# Altium schematic sheet V2.SchDoc
size A3
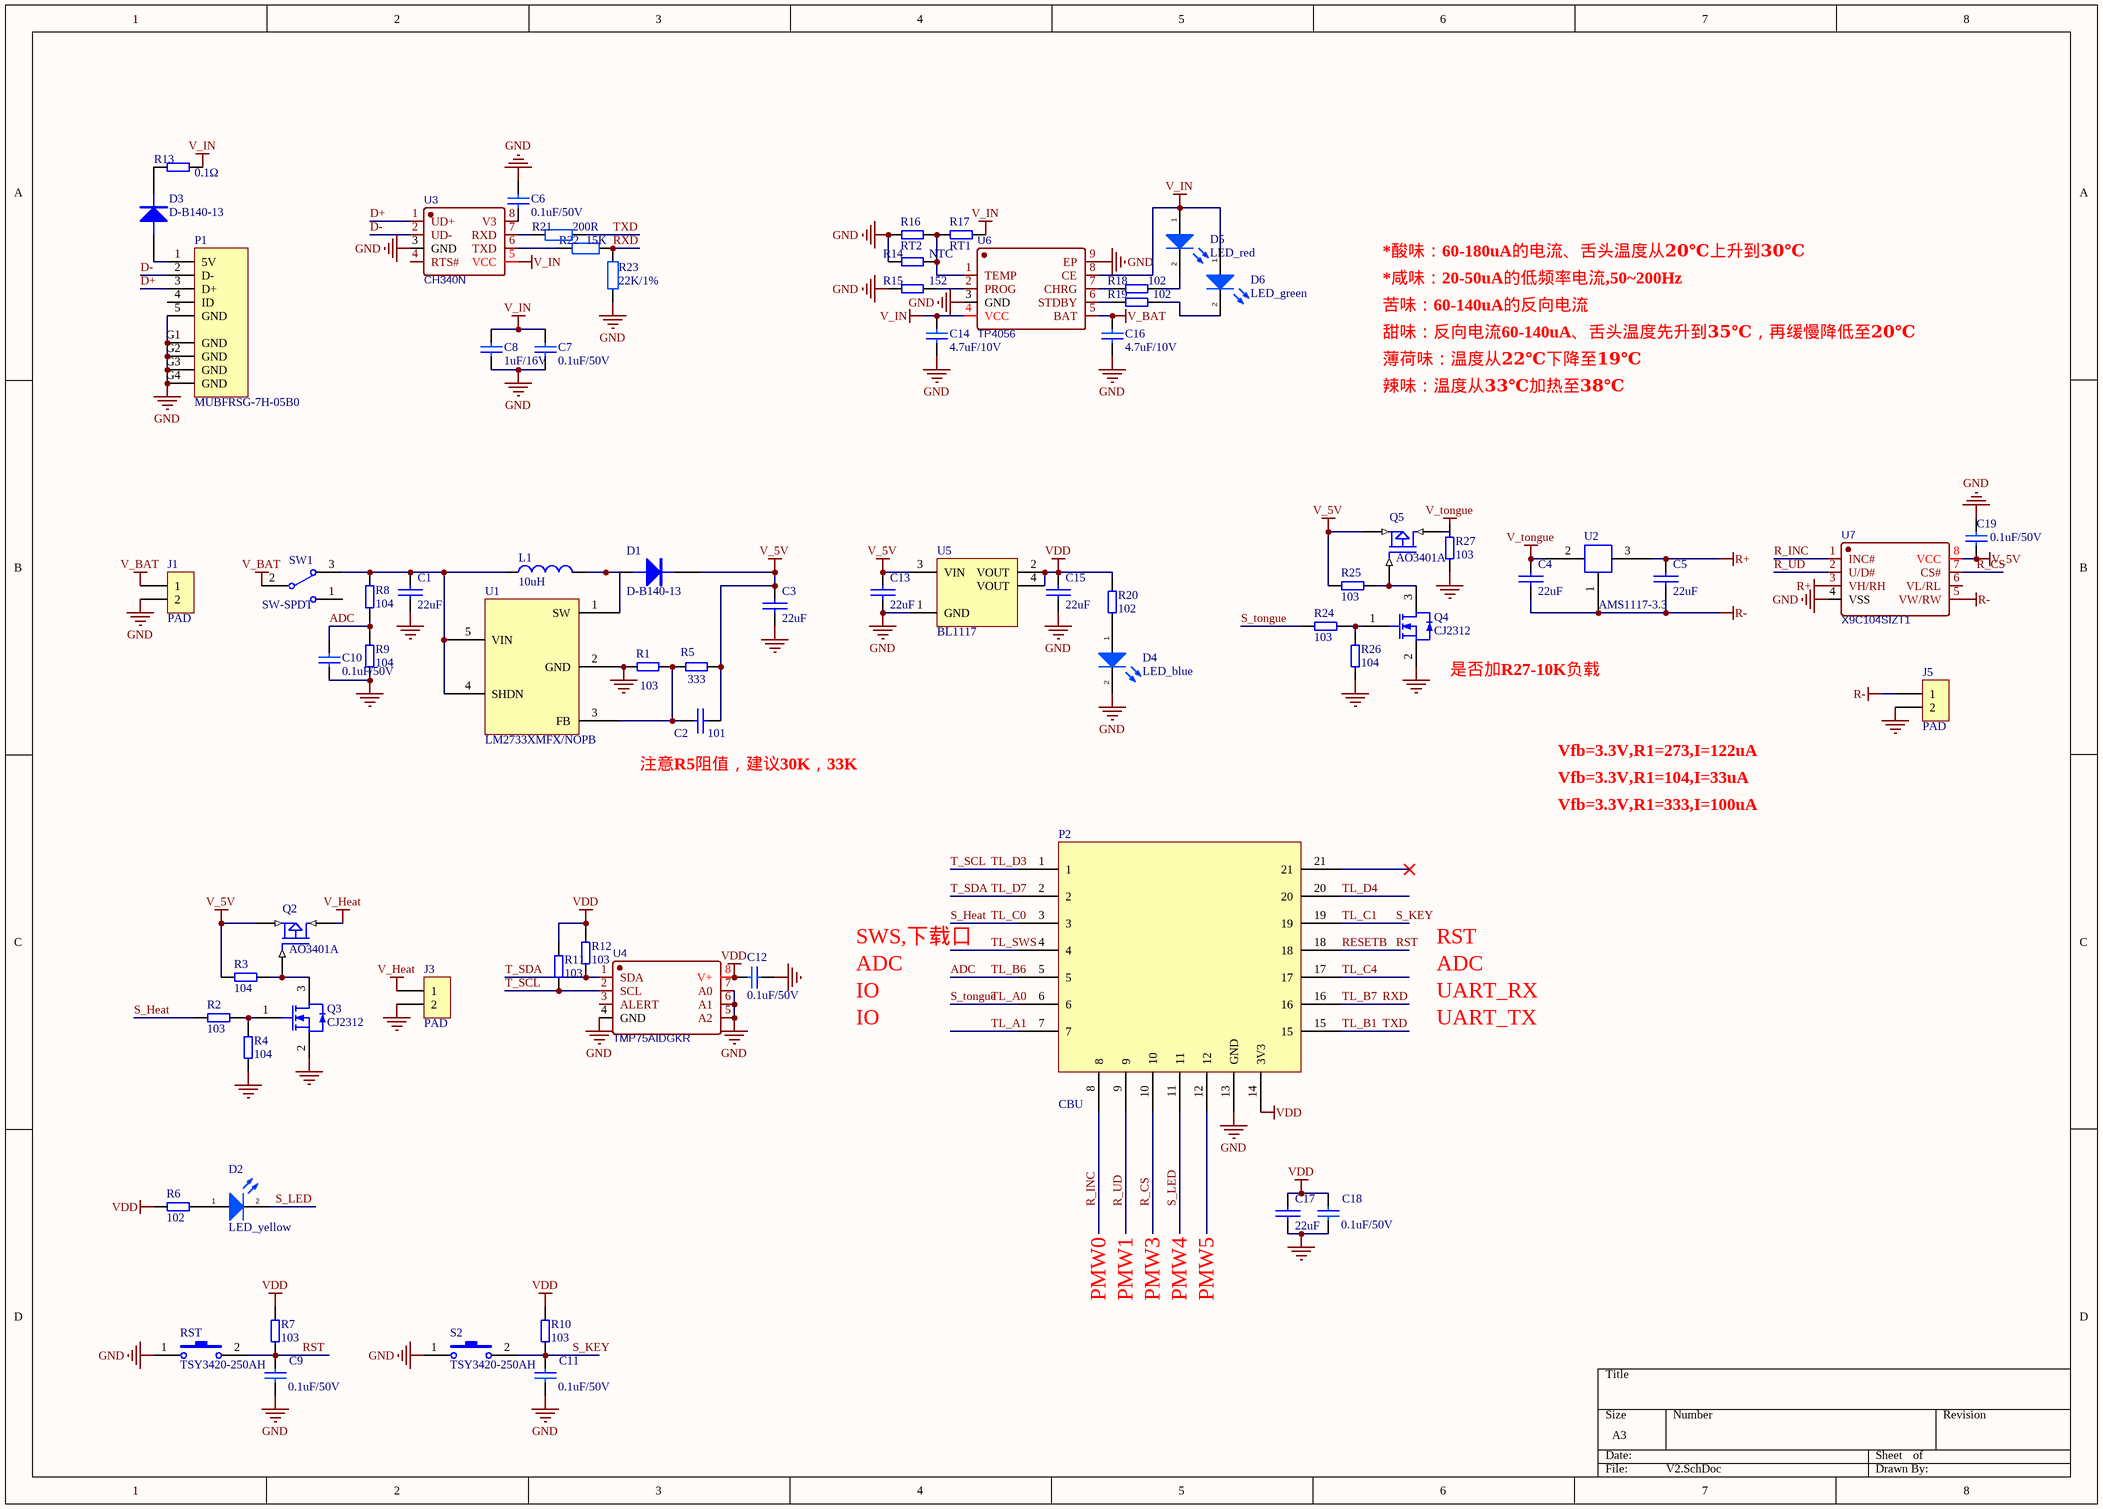
[diagram p0: V2.SchDoc]

## Parts
C1  22uF  [C1206]
C2  101  [C0603]
C3  22uF  [C1206]
C4  22uF  [C1206]
C5  22uF  [C1206]
C6  0.1uF/50V  [C0603_GRM18]
C7  0.1uF/50V  [C0603_GRM18]
C8  1uF/16V  [C0603_GRM18]
C9  0.1uF/50V  [C0603_GRM18]
C10  0.1uF/50V  [C0603_GRM18]
C11  0.1uF/50V  [C0603_GRM18]
C12  0.1uF/50V  [C0603_GRM18]
C13  22uF  [C1206]
C14  4.7uF/10V  [C0603_GRM18]
C15  22uF  [C1206]
C16  4.7uF/10V  [C0603_GRM18]
C17  22uF  [C1206]
C18  0.1uF/50V  [C0603_GRM18]
C19  0.1uF/50V  [C0603_GRM18]
D1  D-B140-13  [XF-SS12C]
D2  LED_yellow  [LED0603]
D3  D-B140-13  [XF-SS12C]
D4  LED_blue  [LED0603]
D5  LED_red  [LED0603]
D6  LED_green  [LED0603]
J1  PAD  [POW_5#]
J3  PAD  [HDR1X2]
J5  PAD  [HDR1X2]
L1  value 10uH  [CD73]  (hidden comment: 4.7uH)
P1  MUBFRSG-7H-05B0  [MIRCOUSB_5PIN-A]
P2  CBU  [CBU-PCBA]
Q2  AO3401A  [SOT-23]
Q3  CJ2312  [SOT23-3]
Q4  CJ2312  [SOT23-3]
Q5  AO3401A  [SOT-23]
R1  103  [R0603]
R2  103  [R0603]
R3  104  [R0603]
R4  104  [R0603]
R5  333  [R0603]
R6  102  [R0603]
R7  103  [R0603]
R8  104  [R0603]
R9  104  [R0603]
R10  103  [R0603]
R11  103  [R0603]
R12  103  [R0603]
R13  0.1Ω  [R0603]
R14  NTC  [R0603]
R15  152  [R0603]
R16  RT2  [R0603]
R17  RT1  [R0603]
R18  102  [R0603]
R19  102  [R0603]
R20  102  [R0603]
R21  200R  [R0603]
R22  15K  [R0603]
R23  22K/1%  [R0603]
R24  103  [R0603]
R25  103  [R0603]
R26  104  [R0603]
R27  103  [R0603]
RST  TSY3420-250AH  [SW-PB2_SMT-3X4]
S2  TSY3420-250AH  [SW-PB2_SMT-3X4]
SW1  SW-SPDT  [pow_switch]
U1  LM2733XMFX/NOPB  [SOT23-5]
U2  AMS1117-3.3  [SOT-89C]
U3  CH340N  [SOP-8]
U4  TMP75AIDGKR  [VSSOP-8_L3.0-W3.0-P0.65-LS5.0-BL]
U5  BL1117  [SOT-223]
U6  TP4056  [ESOP-8]
U7  X9C104SIZT1  [SOIC-8_L4.9-W3.9-P1.27-LS6.0-BL]

## Nets
GND: C1.2 C3.2 C6.2 C7.1 C8.1 C9.2 C10.1 C11.2 C12.1 C13.2 C14.1 C15.2 C16.1 C17.2 C18.2 C19.2 D4.2 J1.2 J3.2 J5.2 P1.5(GND) P1.G1(GND) P1.G2(GND) P1.G3(GND) P1.G4(GND) P2.13(GND) Q3.2(S) Q4.2(S) R1.1 R4.1 R9.1 R14.2 R15.2 R16.1 R23.1 R26.1 R27.1 RST.1 S2.1 U1.2(GND) U3.3(GND) U4.4(GND) U4.5(A2) U4.6(A1) U4.7(A0) U5.1(GND) U6.3(GND) U6.9(EP) U7.4(VSS)
R+: C5.1 U2.3 U7.3(VH/RH)
R-: C4.2 C5.2 J5.1 U2.1 U7.5(VW/RW)
V_5V: C2.1 C3.1 C13.1 C19.1 D1.K Q2.S Q5.S R3.1 R5.1 R25.1 U5.3(VIN) U7.8(VCC)
V_BAT: C16.2 J1.1 SW1.2 U6.5(BAT)
V_Heat: J3.1 Q2.D
V_IN: C7.2 C8.2 C14.2 D5.1 D6.1 R13.1 R17.1 U3.5(VCC) U6.4(VCC) U6.8(CE)
V_tongue: C4.1 Q5.D U2.2
VDD: C12.2 C15.1 C17.1 C18.1 P2.14(3V3) R6.1 R7.2 R10.2 R11.2 R12.2 R20.2 U4.8(V+) U5.2(VOUT) U5.4(VOUT)
ADC: C10.2 P2.5 R8.1 R9.2  [also labelled TL_B6]
D+: P1.3(D+) U3.1(UD+)
D-: P1.2(D-) U3.2(UD-)
R_CS: P2.10 U7.7(CS#)
R_INC: P2.8 U7.1(INC#)
R_UD: P2.9 U7.2(U/D#)
RESETB: C9.1 P2.18 R7.1 RST.2  [also labelled RST]
RXD: P2.16 R22.2 R23.2  [also labelled TL_B7]
S_Heat: P2.3 R2.1  [also labelled TL_C0]
S_KEY: C11.1 P2.19 R10.1 S2.2  [also labelled TL_C1]
S_LED: D2.2 P2.11
S_tongue: P2.6 R24.1  [also labelled TL_A0]
T_SCL: P2.1 R11.1 U4.2(SCL)  [also labelled TL_D3]
T_SDA: P2.2 R12.1 U4.1(SDA)  [also labelled TL_D7]
TL_A1: P2.7
TL_B1: P2.15 R21.2  [also labelled TXD]
TL_C4: P2.17
TL_D4: P2.20
TL_SWS: P2.4
NetC1_1: C1.1 L1.1 R8.2 SW1.3 U1.4(SHDN) U1.5(VIN)
NetC2_2: C2.2 R1.2 R5.2 U1.3(FB)
NetC6_1: C6.1 U3.8(V3)
NetD1_A: D1.A L1.2 U1.1(SW)
NetD2_1: D2.1 R6.2
NetD3_A: D3.A P1.1(5V)
NetD3_K: D3.K R13.2
NetD4_1: D4.1 R20.1
NetD5_2: D5.2 R18.2
NetD6_2: D6.2 R19.1
NetQ2_G: Q2.G Q3.3(D) R3.2
NetQ3_1: Q3.1(G) R2.2 R4.2
NetQ4_1: Q4.1(G) R24.2 R26.2
NetQ4_3: Q4.3(D) Q5.G R25.2
NetR14_1: R14.1 R16.2 R17.2 U6.1(TEMP)
NetR15_1: R15.1 U6.2(PROG)
NetR18_1: R18.1 U6.7(CHRG)
NetR19_2: R19.2 U6.6(STDBY)
NetR21_1: R21.1 U3.7(RXD)
NetR22_1: R22.1 U3.6(TXD)

Not connected (* = marked no-connect by the designer): P1 4(ID); P2 12 21*; R27 2; SW1 1; U3 4(RTS#); U4 3(ALERT); U7 6(VL/RL)

## Notes on the sheet
- *酸味：60-180uA的电流、舌头温度从20℃上升到30℃
- *咸味：20-50uA的低频率电流,50~200Hz
- 苦味：60-140uA的反向电流
- 甜味：反向电流60-140uA、舌头温度先升到35℃，再缓慢降低至20℃
- 薄荷味：温度从22℃下降至19℃
- 辣味：温度从33℃加热至38℃
- (near Q4) 是否加R27-10K负载
- (near C2) 注意R5阻值，建议30K，33K
- Vfb=3.3V,R1=104,I=33uA
- Vfb=3.3V,R1=273,I=122uA
- Vfb=3.3V,R1=333,I=100uA
- SWS,下载口
- ADC
- RST
- IO
- UART_TX
- UART_RX
- PMW0
- PMW1
- PMW3
- PMW4
- PMW5

## Library data of the parts
C1 C3-C5 C13 C15 C17 = C1
C2 = CAP: Capacitor
C6 C7 = 1.02.05.00834: 无极性电容; 物料通用性等级: 高; 工作温度: null; 物料描述: 瓷介电容;贴片;X7R;0.1UF;±10%;50V;0603; 制造商: 华科; 制造商型号: 0603B104K500CT; Orcad Library: C; Orcad Library Path: Z:\tuya_lib\sch-lib\DISCRETE.OLB; Orcad Footprint: c0603,c0603a; Orcad Footprint Path: Z:\tuya_lib\footprint; 管脚数量: 2; 安装方式: 贴片; 物料类目: 瓷介电容; 物料状态: 已发布; 修改人: system; 物料生产状态: 量产; Part Number: 1.02.05.00834; Value: 0.1uF/50V; ComponentLink2Description: null; ComponentLink2URL: null; 器件高度: null; 更新时间: 2021-03-25 10:51:02; ALT_SYMBOLS: c0603,c0603a
C8 = 1.02.03.00181: 无极性电容; 物料通用性等级: 高; 工作温度: null; 物料描述: 瓷介电容;贴片;X7R;1UF;±10%;16V;0603; 制造商: 三星(SAMSUNG); 制造商型号: CL10B105KO8NNNC; Orcad Library: #N/A; 管脚数量: 2; 安装方式: 贴片; 物料类目: 瓷介电容; 物料状态: 已发布; 修改人: system; 物料生产状态: 量产; Part Number: 1.02.03.00181; Value: 1uF/16V; ComponentLink2Description: 三星MLCC.pdf; ComponentLink2URL: file:///\\172.16.246.8\lib-ad\DBlib\Datasheet\电容类资料\三星MLCC.pdf; Orcad Library Path: #N/A; Orcad Footprint: #N/A; Orcad Footprint Path: #N/A; 器件高度: null; 更新时间: 2021-03-25 10:51:02; ALT_SYMBOLS: #N/A
C9-C12 C18 C19 = 1.02.05.00150: 无极性电容; 物料通用性等级: 高; 工作温度: null; 物料描述: 瓷介电容;贴片;X7R;0.1UF;±10%;50V;0603; 制造商: 三星(SAMSUNG); 制造商型号: CL10B104KB8NNNC; Orcad Library: C; Orcad Library Path: Z:\tuya_lib\sch-lib\DISCRETE.OLB; Orcad Footprint: c0603,c0603a; Orcad Footprint Path: Z:\tuya_lib\footprint; 管脚数量: 2; 安装方式: 贴片; 物料类目: 瓷介电容; 物料状态: 已发布; 修改人: system; 物料生产状态: 量产; Part Number: 1.02.05.00150; Value: 0.1uF/50V; ComponentLink2Description: null; ComponentLink2URL: null; 器件高度: null; 更新时间: 2021-03-25 10:51:02; ALT_SYMBOLS: c0603,c0603a
C14 C16 = 1.02.05.00710: 无极性电容; 物料通用性等级: 高; 工作温度: null; 物料描述: 瓷介电容;贴片;X5R;4.7UF;±10%;10V;0603;; 制造商: 三星(SAMSUNG); 制造商型号: CL10A475KP8NNNC; Orcad Library: C; Orcad Library Path: Z:\tuya_lib\sch-lib\DISCRETE.OLB; Orcad Footprint: c0603,c0603a; Orcad Footprint Path: Z:\tuya_lib\footprint; 管脚数量: 2; 安装方式: 贴片; 物料类目: 瓷介电容; 物料状态: 已发布; 修改人: system; Part Number: 1.02.05.00710; Value: 4.7uF/10V; ComponentLink2Description: null; ComponentLink2URL: null; 器件高度: null; 更新时间: 2021-03-25 10:51:02; ALT_SYMBOLS: c0603,c0603a
D1 D3 = DIODE: $MaterialID: 40300.000001; $MaterialClass: Diode; Specification: D-B140-13
D2 D4 D5 = 1.06.02.00449: LED; Value: HS211TG13-02; 物料通用性等级: 高; 工作温度: null; 物料描述: 发光二极管;翠绿;30MA;2.6~3.3V;0603;贴片;发光角130°; 制造商: 翔光光电; Orcad Library: LED_YG; Orcad Library Path: Z:\tuya_lib\sch-lib\DISCRETE.OLB; Orcad Footprint Path: Z:\tuya_lib\footprint; 管脚数量: 2; 器件高度: 0.6mm; 安装方式: 贴片; 物料类目: 发光二极管; 物料状态: 已发布; 修改人: system; Part Number: 1.06.02.00449; ComponentLink2Description: HS211TG13-02.pdf; ComponentLink2URL: file:///\\172.16.246.8\lib-ad\DBlib\Datasheet\二极管资料\HS211TG13-02.pdf; 制造商型号: HS211TG13-02; Orcad Footprint: led0603; 更新时间: 2021-03-25 10:51:02
D6 = 1.06.02.00449: LED; Value: HS211TG13-02; 物料通用性等级: 高; 工作温度: null; 物料描述: 发光二极管;翠绿;30MA;2.6~3.3V;0603;贴片;发光角130°; 制造商: 翔光光电; Orcad Library: LED_YG; Orcad Library Path: Z:\tuya_lib\sch-lib\DISCRETE.OLB; Orcad Footprint Path: Z:\tuya_lib\footprint; 管脚数量: 2; 器件高度: 0.6mm; 安装方式: 贴片; 物料类目: 发光二极管; 物料状态: 已发布; 修改人: system; 物料生产状态: 量产; Part Number: 1.06.02.00449; ComponentLink2Description: HS211TG13-02.pdf; ComponentLink2URL: file:///\\172.16.246.8\lib-ad\DBlib\Datasheet\二极管资料\HS211TG13-02.pdf; 制造商型号: HS211TG13-02; Orcad Footprint: led0603; 更新时间: 2021-03-25 10:51:02
J1 J3 J5 = CON2: Connector
L1 = Inductor: Code_IEC: 1005; Published: 8-Jun-2000; LatestRevisionDate: 29-May-2009; LatestRevisionNote: IPC-7351 Footprint Added.; PackageReference: CD73; Publisher: Altium Limited; PackageDescription: Chip Inductor; Code_JEITA: 0402
P1 = 1.16.99.00399: USB; 物料通用性等级: 低; 工作温度: null; 物料描述: USB;MICROUSB;5PIN;卧式;垂直;卷边;贴片; 制造商: 科信成; Orcad Library: USB_A01SB141B3_9P; Orcad Library Path: Z:\tuya_lib\sch-lib\IO.OLB; Orcad Footprint: USB-U2BF-YFXXX-9; Orcad Footprint Path: Z:\tuya_lib\footprint; 管脚数量: 9; 器件高度: 2.5mm; 安装方式: 贴片; 物料状态: 已发布; 修改人: system; Part Number: 1.16.99.00399; Value: MUBFRSG-7H-05B0; ComponentLink2Description: MICRO-USB-5P.pdf; ComponentLink2URL: file:///\\172.16.246.8\lib-ad\DBlib\Datasheet\接插件资料\MICRO-USB-5P.pdf; 制造商型号: MUBFRSG-7H-05B0; 物料类目: USB; 更新时间: 2021-03-25 10:51:02
P2 = 0110: Part Number: 0110; 制造商: 涂鸦; Process: 贴片; Component Type: Standard; 描述: CBU; 制造商型号: CBU; Pin Count: 21; Value: CBU
Q2 Q5 = MOSFET-P: $MaterialClass: FET; Specification: AO3401A
Q3 Q4 = 1.06.11.00008: N-Channel MOSFET; 物料通用性等级: 高; 工作温度: null; 物料描述: 场效应管;N沟道;CJ2312;20V;5A;31.8MR/4.5V;SOT-23;贴片; 制造商: 江苏长电; Orcad Library: FETN_GSD; Orcad Library Path: ‪Z:\tuya_lib\sch-lib\DISCRETE.OLB; Orcad Footprint Path: Z:\tuya_lib\footprint; 管脚数量: 3; 器件高度: 1.15mm; 安装方式: 贴片; 物料类目: 场效应管; 物料状态: 已发布; 修改人: system; 物料生产状态: 量产; Part Number: 1.06.11.00008; Value: CJ2312; ComponentLink2Description: CJ2312.pdf; ComponentLink2URL: file:///\\172.16.246.8\lib-ad\DBlib\Datasheet\三极管资料\CJ2312.pdf; 制造商型号: CJ2312; Orcad Footprint: sot23-3; 更新时间: 2021-03-25 10:51:02
R1 R5 R11 R12 = RES-1: RES; Accuracy: ±1%
  R1 R11 R12: Value: 103
  R5: Value: 333
R2-R4 R6-R10 R13-R20 R24-R27 = RES-1: RES
R21 = 1.01.01.00808: 电阻; 物料通用性等级: 中; 工作温度: null; 物料描述: 普通电阻;200R;±5%;0603;1/10W;贴片;; 制造商: 厚声(UniOhm); 制造商型号: 0603WAJ0201***; Orcad Library: R; Orcad Library Path: Z:\tuya_lib\sch-lib\DISCRETE.OLB; Orcad Footprint Path: Z:\tuya_lib\footprint; 管脚数量: 2; 安装方式: 贴片; 物料类目: 普通电阻; 物料状态: 已发布; 修改人: system; 物料生产状态: 量产; Part Number: 1.01.01.00808; Value: 200R; ComponentLink2Description: 厚生电阻规格书.pdf; ComponentLink2URL: file:///\\172.16.246.8\lib-ad\DBlib\Datasheet\电阻类\厚生电阻规格书.pdf; Orcad Footprint: r0603; 器件高度: null; 更新时间: 2021-03-25 10:51:02; ALT_SYMBOLS: r0603
R22 = 1.01.01.01301: 电阻; 物料通用性等级: 高; 工作温度: null; 物料描述: 普通电阻;15K;±5%;0603;1/10W;贴片;; 制造商: 厚声(UniOhm); 制造商型号: 0603WAJ0153***; Orcad Library: R; Orcad Library Path: Z:\tuya_lib\sch-lib\DISCRETE.OLB; Orcad Footprint Path: Z:\tuya_lib\footprint; 管脚数量: 2; 安装方式: 贴片; 物料类目: 普通电阻; 物料状态: 已发布; 修改人: system; 物料生产状态: 量产; Part Number: 1.01.01.01301; Value: 15K; ComponentLink2Description: null; ComponentLink2URL: null; Orcad Footprint: r0603; 器件高度: null; 更新时间: 2021-03-25 10:51:02; ALT_SYMBOLS: r0603
R23 = 1.01.01.01030: 电阻; 物料通用性等级: 高; 工作温度: null; 物料描述: 普通电阻;22K;±1%;0603;1/10W;贴片;; 制造商: 厚声(UniOhm); 制造商型号: 0603WAF2202***; Orcad Library: R; Orcad Library Path: Z:\tuya_lib\sch-lib\DISCRETE.OLB; Orcad Footprint Path: Z:\tuya_lib\footprint; 管脚数量: 2; 安装方式: 贴片; 物料类目: 普通电阻; 物料状态: 已发布; 修改人: system; 物料生产状态: 量产; Part Number: 1.01.01.01030; Value: 22K/1%; ComponentLink2Description: 厚生电阻规格书.pdf; ComponentLink2URL: file:///\\172.16.246.8\lib-ad\DBlib\Datasheet\电阻类\厚生电阻规格书.pdf; Orcad Footprint: r0603; 器件高度: null; 更新时间: 2021-03-25 10:51:02; ALT_SYMBOLS: r0603
RST S2 = 1.13.04.00024: 2pin轻触开关（无固定脚）; 物料通用性等级: 中; 工作温度: null; 物料描述: 轻触开关;3*4*2MM;贴片;; 制造商: 欧麦特; Orcad Library: #N/A; 管脚数量: 2; 器件高度: 1.95mm; 安装方式: 贴片; 物料类目: 轻触开关; 物料状态: 已发布; 修改人: system; Part Number: 1.13.04.00024; Value: TSY3420-250AH; ComponentLink2Description: TSY3420-250AH规格书.pdf; ComponentLink2URL: file:///\\172.16.246.8\lib-ad\DBlib\Datasheet\开关资料\TSY3420-250AH规格书.pdf; 制造商型号: TSY3420-250AH; Orcad Library Path: #N/A; Orcad Footprint: #N/A; Orcad Footprint Path: #N/A; 更新时间: 2021-03-25 10:51:02; ALT_SYMBOLS: #N/A
SW1 = SW-SPDT: SPDT Subminiature Toggle Switch, Right Angle Mounting, Vertical Actuation; Published: 24-Mar-1999; LatestRevisionDate: 17-Dec-2003; LatestRevisionNote: Schematic revised, PCB Footprint replaced.; DatasheetVersion: 05-Dec-2000; PackageReference: TL36WW15050; Publisher: Altium Limited; PackageDescription: Switch; 4 Leads; ComponentLink1Description: Manufacturer Link; ComponentLink1URL: http://www.apem.com
U1 = LM2733: $MaterialClass: IC; $MaterialID: 40700.000017; Specification: LM2733XMFX/NOPB
U2 = WYK
U3 = CH340N: BOM_Manufacturer: WCH(Jiangsu Qin Heng); Contributor: LCSC; BOM_Paste Type: expand; BOM_Supplier: LCSC; BOM_Supplier Part: C506813; BOM_Manufacturer Part: CH340N; spicePre: U; spiceSymbolName: CH340N
U4 = TMP75AIDGKR: BOM_Manufacturer: TI; Contributor: LCSC; BOM_Paste Type: expand; BOM_Supplier: LCSC; BOM_Manufacturer Part: TMP75AIDGKR; BOM_Supplier Part: C105258; spicePre: U; spiceSymbolName: TMP75AIDGKR
U5 = 1.05.99.00236: 线性稳压源; 物料通用性等级: 高; 工作温度: null; 物料描述: 电源芯片-LDO 稳压器;LDO;BL1117-33CX;12V;3.3V;1A;SOT223;贴片; 制造商: 贝岭; 制造商型号: BL1117-33CX  SOT223-3L; Orcad Library: BL1117C_SOT223_3P; Orcad Library Path: Z:\tuya_lib\sch-lib\IC.OLB; Orcad Footprint: sot223-3; Orcad Footprint Path: Z:\tuya_lib\footprint; 管脚数量: 4; 器件高度: 1.7mm; 安装方式: 贴片; 物料类目: 电源芯片-LDO 稳压器; 物料状态: 已发布; 修改人: system; 物料生产状态: 量产; Part Number: 1.05.99.00236; Value: BL1117; ComponentLink2Description: BL1117-33CX.pdf; ComponentLink2URL: file:///\\172.16.246.8\lib-ad\DBlib\Datasheet\IC资料\BL1117-33CX.pdf; 更新时间: 2021-03-25 10:51:02
U6 = TP4056_C725790: BOM_Manufacturer: UMW(Youtai Semiconductor Co., Ltd.); Contributor: LCSC; BOM_Paste Type: expand; BOM_Supplier: LCSC; BOM_Supplier Part: C725790; BOM_Manufacturer Part: TP4056; spicePre: U; spiceSymbolName: TP4056_C725790
U7 = X9C104SIZT1: BOM_Manufacturer: Intersil; BOM_Paste Type: expand; BOM_Supplier: LCSC; BOM_Manufacturer Part: X9C104SIZT1; image: //image.lceda.cn/szlcsc/C11979.jpg; BOM_Supplier Part: C11979; spicePre: U; spiceSymbolName: X9C104SIZT1